# Altium schematic sheet Power.SchDoc
size A4
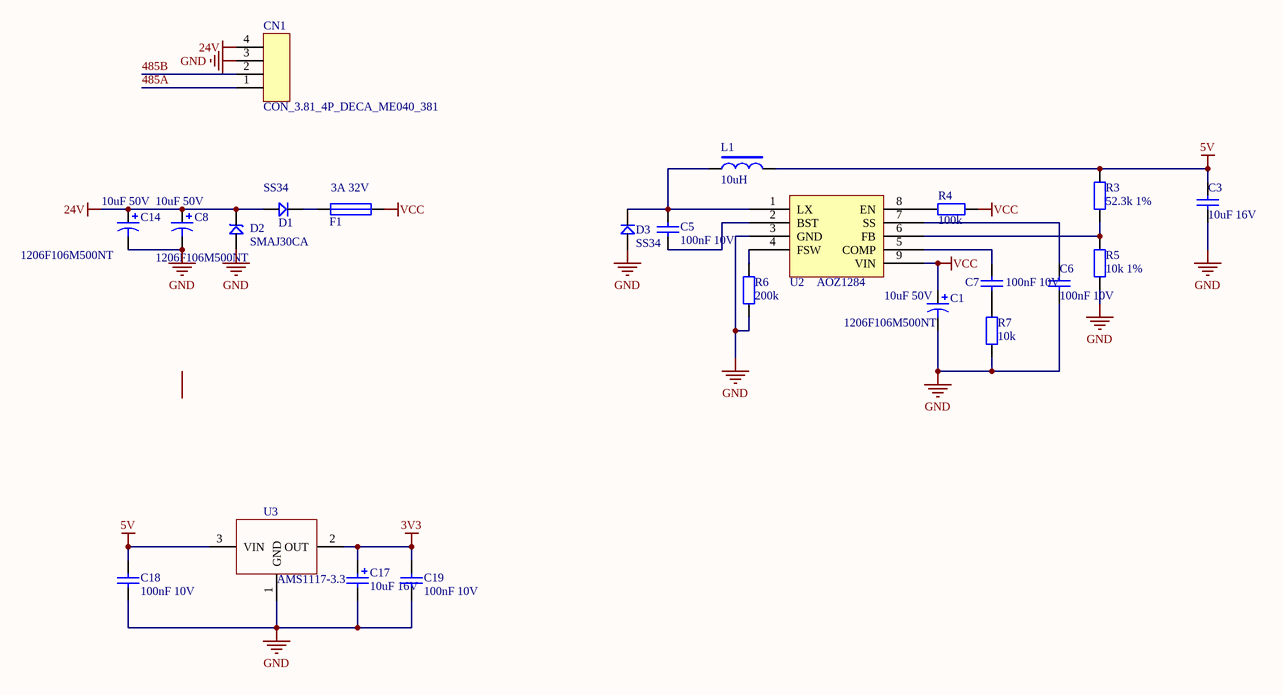
[diagram p0: Power.SchDoc]

## Parts
C1  10uF 50V  名称: 1206F106M500NT  [C1206]
C3  10uF 16V  [C1206]
C5  100nF 10V  [C0603]
C6  100nF 10V  [C0603]
C7  100nF 10V  [C0603]
C8  10uF 50V  名称: 1206F106M500NT  [C1206]
C14  10uF 50V  名称: 1206F106M500NT  [C1206]
C17  10uF 16V  [C1206]
C18  100nF 10V  [C0603]
C19  100nF 10V  [C0603]
CN1  CON_3.81_4P_DECA_ME040_381  [ME040_381_4P_VC-1]
D1  SS34  [LC-SMA(DO-214AC)_S3]
D2  SMAJ30CA  [LC-SMA(DO-214AC)_S3]
D3  SS34  [LC-SMA(DO-214AC)_S3]
F1  3A 32V  [C1206]
L1  10uH  [L_SOP74]
R3  52.3k 1%  [R0603]
R4  100k  [R0603]
R5  10k 1%  [R0603]
R6  200k  [R0603]
R7  10k  [R0603]
U2  AOZ1284  [LC-SOP-8_150mil]
U3  AMS1117-3.3  [LT1117]

## Nets
3V3: C17.1 C19.2 U3.2(OUT)
5V: C3.1 C18.2 L1.2 R3.2 U3.3(VIN)
24V: C8.1 C14.1 CN1.4 D1.1 D2.2
GND: C1.2 C3.2 C6.2 C8.2 C14.2 C17.2 C18.1 C19.1 CN1.3 D2.1 D3.1 R5.1 R6.1 R7.1 U2.3(GND) U3.1(GND)
VCC: C1.1 F1.2 R4.2 U2.9(VIN)
485A: CN1.1
485B: CN1.2
NetC5_1: C5.1 U2.2(BST)
NetC5_2: C5.2 D3.2 L1.1 U2.1(LX)
NetC6_1: C6.1 U2.7(SS)
NetC7_1: C7.1 U2.5(COMP)
NetC7_2: C7.2 R7.2
NetD1_2: D1.2 F1.1
NetR3_1: R3.1 R5.2 U2.6(FB)
NetR4_1: R4.1 U2.8(EN)
NetR6_2: R6.2 U2.4(FSW)

## Library data of the parts
C1 C8 C14 = Cap Pol1: 贴片陶瓷电容; Value: 220uF/50V 8*12; Published: 8-Jun-2000; LatestRevisionDate: 17-Jul-2002; LatestRevisionNote: Re-released for DXP Platform.; PackageReference: RB7.6-15; Publisher: Altium Limited; PackageDescription: Polarized Capacitor (Radial); 2 Leads
C3 = CAP: 贴片陶瓷电容
C5-C7 C18 C19 = CAP
C17 = CAP1: 贴片陶瓷电容
CN1 = CON_3.81_4P_DECA_ME040_381: DECA connector,3.81mm,1*4P,180度; PartNumber: ME040-381-4P; Manufacturer: DECA
D1 D3 = D
D2 = SMBJ: TVS
F1 = FUSE
L1 = 差模电感: 贴片电感7*7mm
R3-R7 = RES
U3 = LT1117